# EAGLE board EEZ DIB AFE3 r1B2 (EAGLE 7.2.0)
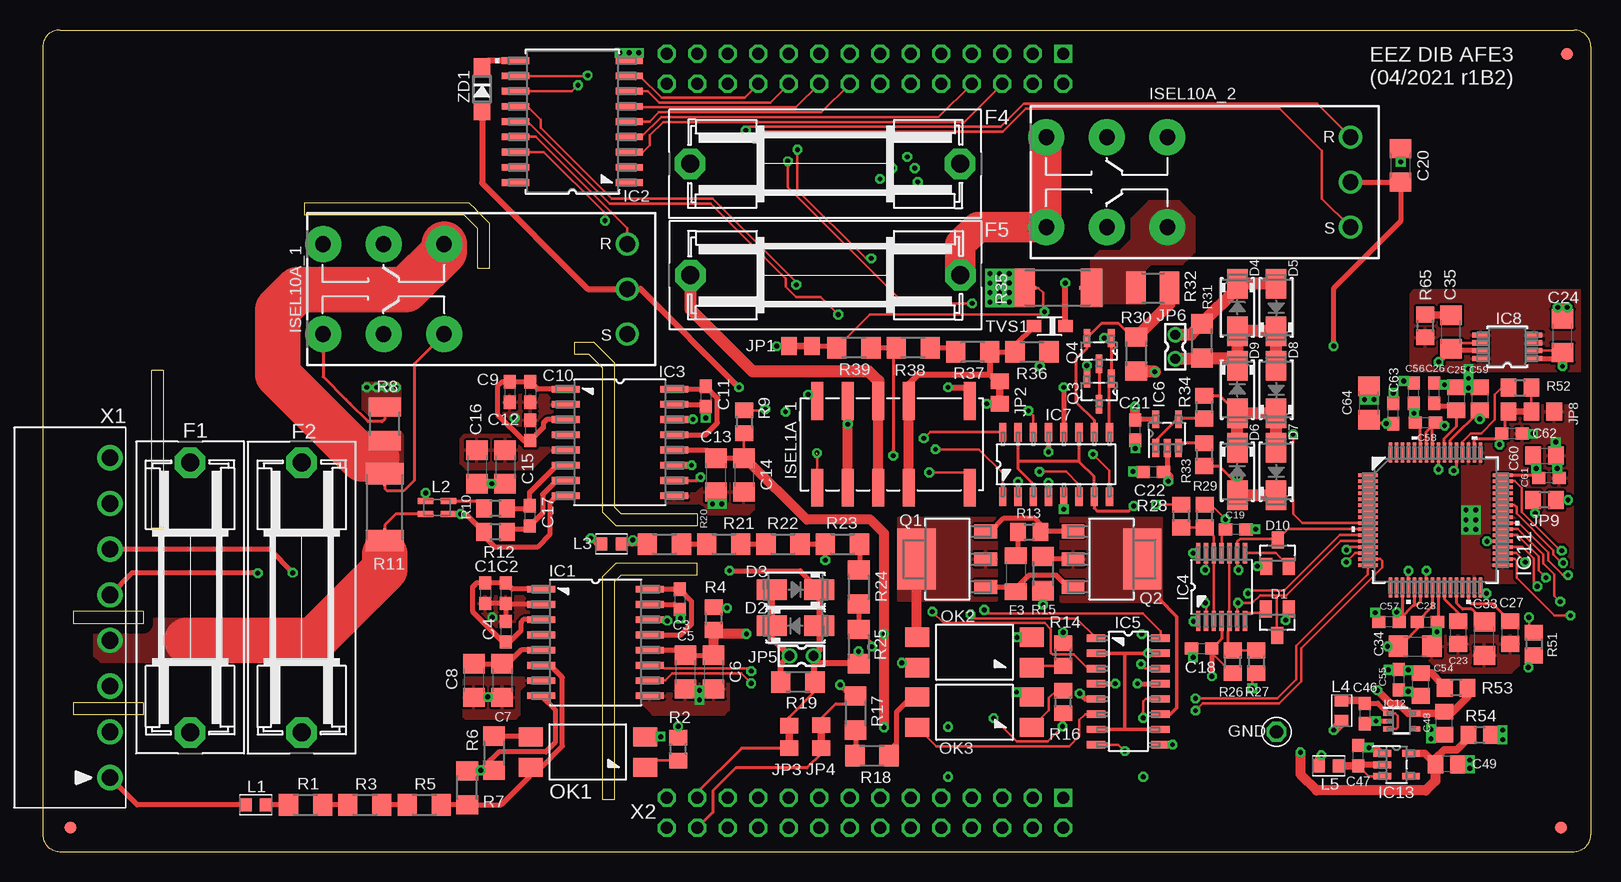
[diagram p4: board, top side]
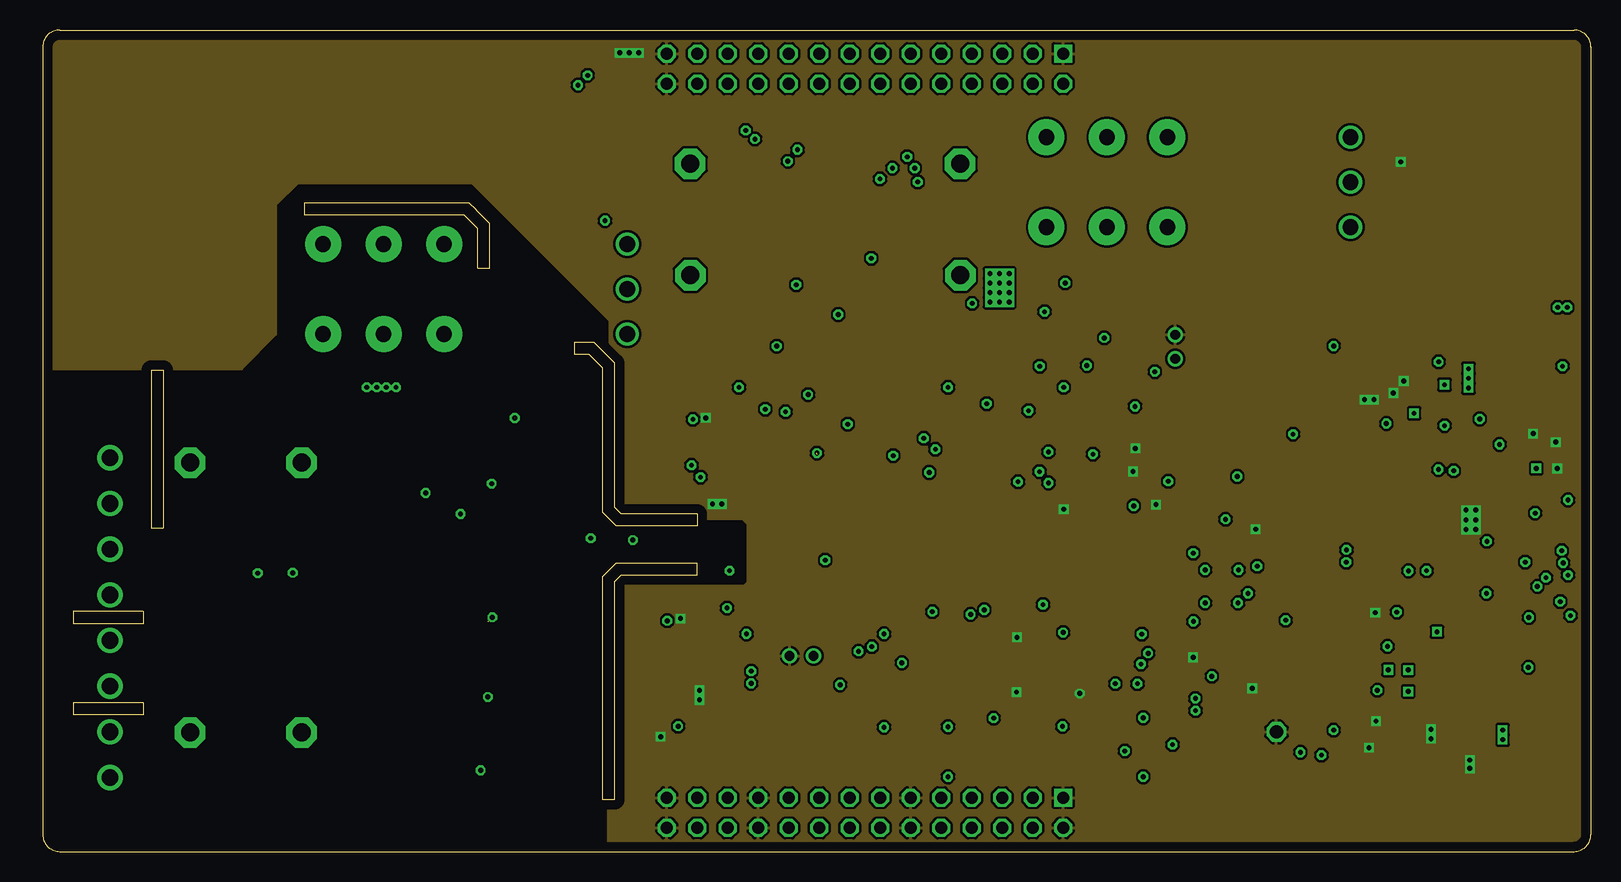
[diagram p5: board, inner layer Gnd]
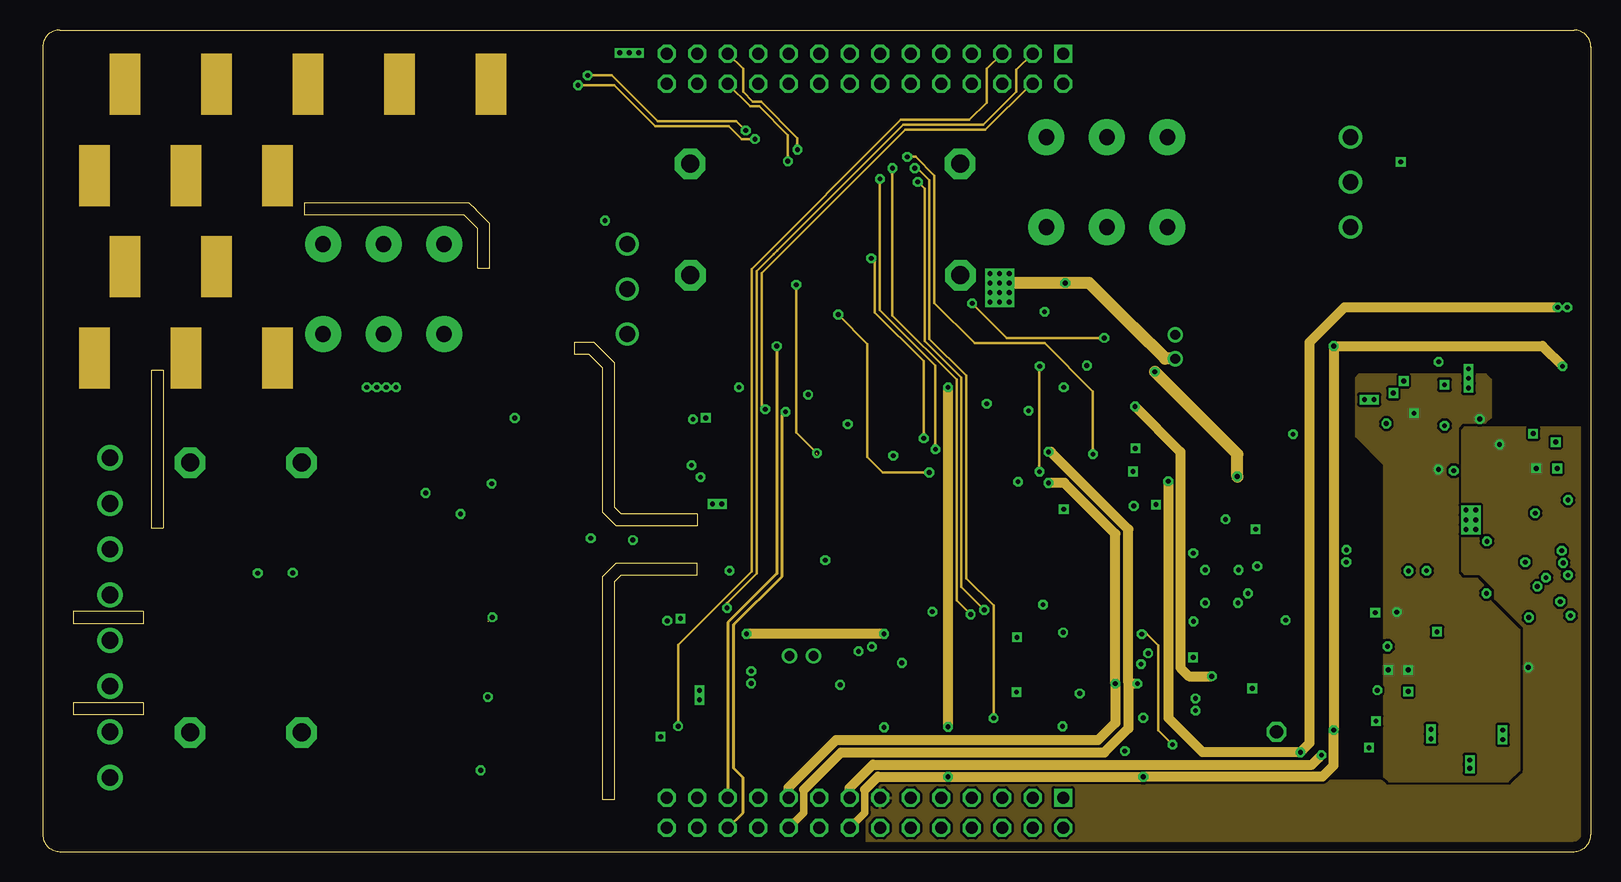
[diagram p6: board, inner layer Power]
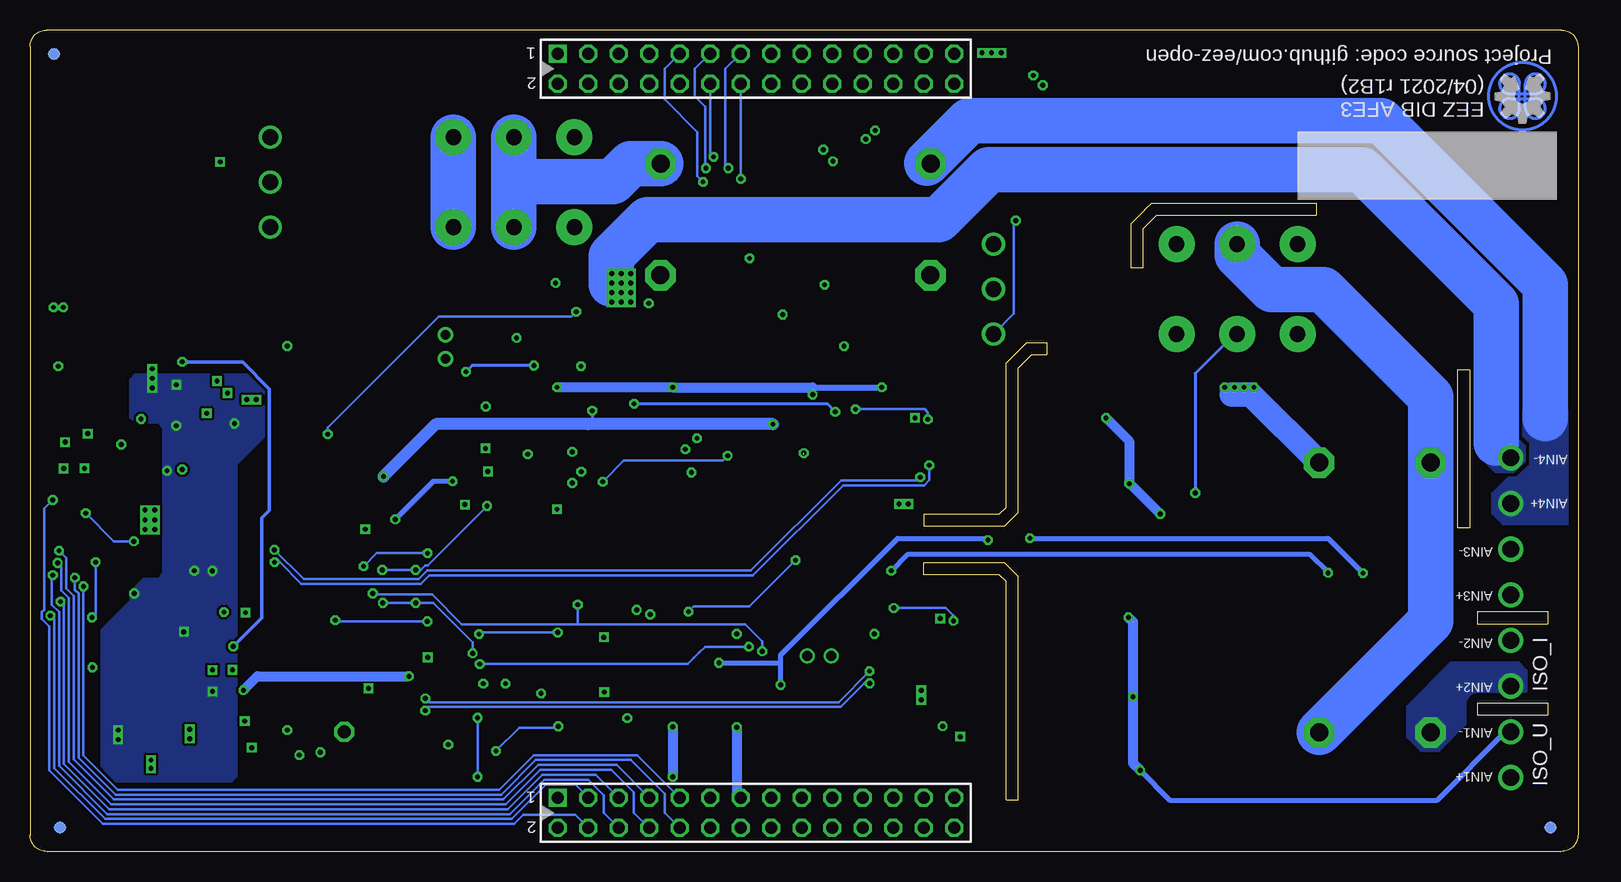
[diagram p7: board, bottom side, seen from below]

Size 129 x 68.5 mm. Coordinates in mm from the lower left corner, seen from the top.
Outline: 36.11,53.5 35.53,54.07 21.81,54.07 21.81,53.06 35.1,53.06 36.23,51.93 36.23,48.66 37.25,48.66 37.25,52.36 36.12,53.49
Outline: 46.52,41.87 45.95,42.44 44.28,42.44 44.28,41.42 45.52,41.42 46.65,40.29 46.65,28.27 47.78,27.14 54.53,27.14 54.53,28.15 48.21,28.15 47.66,28.7 47.66,40.73 46.53,41.86
Outline: 0,67.1 0,1.4 arc90 1.4,0 127.6,0 arc90 129,1.4 129,67.1 arc90 127.6,68.5 1.4,68.5 arc90 0,67.1
Outline: 8.38,20.01 2.54,20.01 2.54,19 8.38,19 8.38,20.01
Outline: 8.38,12.4 2.54,12.4 2.54,11.39 8.38,11.39 8.38,12.4
Outline: 9.03,40.14 9.03,27 10.05,27 10.05,40.14 9.03,40.14
Outline: 48.21,23.06 54.53,23.06 54.53,24.08 47.78,24.08 46.65,22.95 46.65,4.3 47.66,4.3 47.66,22.51 48.21,23.06
Copper layers (1+2+15+16): Top 0.035559375mm / dielectric 7mil / Gnd 0.03048125mm / dielectric 44mil / Power 0.03048125mm / dielectric 7mil / Bottom 0.035559375mm
Design rules "DIB 4-layer *": minimum track width 6mil, minimum drill 0.3mm, track to track 4mil, track to pad 4mil, pad to pad 4mil, via to via 4mil, smd to smd 4mil, copper to edge 30mil, drill to drill 8mil, minimum pad ring 4mil, minimum via ring 8mil, stop-mask expansion 2.5mil, vias tented up to drill 0.6mm, thermal gap 8mil
Net classes: 0 default: width 0.152 mm, drill 0.3 mm, clearance 0.152 mm; 1 lvds: width 0.152 mm, drill 0.3 mm, clearance 0.152 mm to class 0, clearance 0.152 mm; 2 gnd: width 0.254 mm, drill 0.584 mm, clearance 0.254 mm; 3 diff_in: width 0.254 mm, drill 0.584 mm, clearance 0.203 mm to class 0, clearance 0.203 mm to class 1, clearance 0.203 mm to class 2, clearance 0.203 mm
vRestrict: area 0,34.5 to 21,68.5

## Footprints (pad centres in the part's own frame; a part is rotated, then mirrored left to right if it is on the bottom)
C0603 = smd 1.1 x 1: 1 -0.85,0; 2 0.85,0
C1206 = smd 1.6 x 1.8: 1 -1.4,0; 2 1.4,0
C0805 = smd 1.3 x 1.5: 1 -0.95,0; 2 0.95,0
SOT23 = smd 1 x 1.4: 1 -0.95,-1.1; 2 0.95,-1.1; 3 0,1.1
SMA_NARROW = smd 2.464 x 1.702: 1 -1.981,0; 2 1.981,0
ZH32 = drill 1.5 pad 2.54 octagon: 1 -11.25,0; 2 11.25,0
C1206-HV = smd 1.4 x 1.8: 1 -1.5,0; 2 1.5,0
FIDUCIAL_DUAL = smd 1.016 x 1.016 bottom: B 0,0 | smd 1.016 x 1.016: T 0,0
PCB_SHIELD_TAB = drill 1.1 octagon: 1 0,0
DW16 = smd 2.311 x 0.559: 1 -4.521,4.445; 2 -4.521,3.175; 3 -4.521,1.905; 4 -4.521,0.635; 5 -4.521,-0.635; 6 -4.521,-1.905; 7 -4.521,-3.175; 8 -4.521,-4.445; 9 4.521,-4.445; 10 4.521,-3.175; 11 4.521,-1.905; 12 4.521,-0.635; 13 4.521,0.635; 14 4.521,1.905; 15 4.521,3.175; 16 4.521,4.445
DW18_TEX-M = smd 2.286 x 0.559: 1 -4.737,5.08; 2 -4.737,3.81; 3 -4.737,2.54; 4 -4.737,1.27; 5 -4.737,0; 6 -4.737,-1.27; 7 -4.737,-2.54; 8 -4.737,-3.81; 9 -4.737,-5.08; 10 4.737,-5.08; 11 4.737,-3.81; 12 4.737,-2.54; 13 4.737,-1.27; 14 4.737,0; 15 4.737,1.27; 16 4.737,2.54; 17 4.737,3.81; 18 4.737,5.08
PW(R-PDSO-G14) = smd 1.676 x 0.356: 1 -2.819,1.95; 2 -2.819,1.3; 3 -2.819,0.65; 4 -2.819,0; 5 -2.819,-0.65; 6 -2.819,-1.3; 7 -2.819,-1.95; 8 2.819,-1.95; 9 2.819,-1.3; 10 2.819,-0.65; 11 2.819,0; 12 2.819,0.65; 13 2.819,1.3; 14 2.819,1.95
SO16 = smd 1.549 x 0.61: 1 -2.692,4.445; 2 -2.692,3.175; 3 -2.692,1.905; 4 -2.692,0.635; 5 -2.692,-0.635; 6 -2.692,-1.905; 7 -2.692,-3.175; 8 -2.692,-4.445; 9 2.692,-4.445; 10 2.692,-3.175; 11 2.692,-1.905; 12 2.692,-0.635; 13 2.692,0.635; 14 2.692,1.905; 15 2.692,3.175; 16 2.692,4.445
DBV5 = smd 1.473 x 0.559: 1 -1.194,0.95; 2 -1.194,0; 3 -1.194,-0.95; 4 1.194,-0.95; 5 1.194,0.95
MSOP-8_MS_LIT = smd 1.359 x 0.432: 1 -2.229,0.975; 2 -2.229,0.325; 3 -2.229,-0.325; 4 -2.229,-0.975; 5 2.229,-0.975; 6 2.229,-0.325; 7 2.229,0.325; 8 2.229,0.975
PAG64 = smd 1.664 x 0.279: 1 -5.62,3.75; 2 -5.62,3.25; 3 -5.62,2.75; 4 -5.62,2.25; 5 -5.62,1.75; 6 -5.62,1.25; 7 -5.62,0.75; 8 -5.62,0.25; 9 -5.62,-0.25; 10 -5.62,-0.75; 11 -5.62,-1.25; 12 -5.62,-1.75; 13 -5.62,-2.25; 14 -5.62,-2.75; 15 -5.62,-3.25; 16 -5.62,-3.75; 33 5.62,-3.75; 34 5.62,-3.25; 35 5.62,-2.75; 36 5.62,-2.25; 37 5.62,-1.75; 38 5.62,-1.25; 39 5.62,-0.75; 40 5.62,-0.25; 41 5.62,0.25; 42 5.62,0.75; 43 5.62,1.25; 44 5.62,1.75; 45 5.62,2.25; 46 5.62,2.75; 47 5.62,3.25; 48 5.62,3.75 | smd 0.279 x 1.664: 17 -3.75,-5.62; 18 -3.25,-5.62; 19 -2.75,-5.62; 20 -2.25,-5.62; 21 -1.75,-5.62; 22 -1.25,-5.62; 23 -0.75,-5.62; 24 -0.25,-5.62; 25 0.25,-5.62; 26 0.75,-5.62; 27 1.25,-5.62; 28 1.75,-5.62; 29 2.25,-5.62; 30 2.75,-5.62; 31 3.25,-5.62; 32 3.75,-5.62; 49 3.75,5.62; 50 3.25,5.62; 51 2.75,5.62; 52 2.25,5.62; 53 1.75,5.62; 54 1.25,5.62; 55 0.75,5.62; 56 0.25,5.62; 57 -0.25,5.62; 58 -0.75,5.62; 59 -1.25,5.62; 60 -1.75,5.62; 61 -2.25,5.62; 62 -2.75,5.62; 63 -3.25,5.62; 64 -3.75,5.62
DCK5 = smd 0.85 x 0.4: 1 -1.125,0.65; 2 -1.125,0; 3 -1.125,-0.65; 4 1.125,-0.65; 5 1.125,0.65
G6SK-2F = smd 1 x 3.16: 1 -6.35,-3.62; 3 -1.27,-3.62; 4 1.27,-3.62; 5 3.81,-3.62; 6 6.35,-3.62; 7 6.35,3.62; 8 3.81,3.62; 9 1.27,3.62; 10 -1.27,3.62; 12 -6.35,3.62
RT424FXX = drill 1.3 pad 3: 11 20.3,-3.75; 12 15.26,-3.75; 14 25.34,-3.75; 21 20.3,3.75; 22 15.26,3.75; 24 25.34,3.75 | drill 1.3: A1 0,-3.75; A2 0,3.75; A3 0,0
JP2-0805-NOCUT = smd 1.3 x 1.5: 1 -0.95,0; 2 0.95,0
2MM-2 = drill 0.8 pad 1.27: 1 0,-1; 2 0,1
JP3-0805-CUT2 = smd 1.3 x 1.5: COM 0,0; NC 1.9,0; NO -1.9,0
R_0805 = smd 1.3 x 1.5: 1 -0.95,0; 2 0.95,0
BEAD0603 = smd 1 x 1.1: P$1 -0.85,0; P$2 0.85,0
MURATA_DLW21S = smd 1.3 x 0.5: 1 -0.95,-0.55; 2 0.95,-0.55; 3 0.95,0.55; 4 -0.95,0.55
DIL4-SMD = smd 1.6 x 2: 1 -1.27,-4.77; 2 1.27,-4.77; 3 1.27,4.77; 4 -1.27,4.77
SOT230P700X180-4N = smd 1.905 x 1.143: 1 -3.2,2.311; 2 -3.2,0; 3 -3.2,-2.311 | smd 3.175 x 5.08: 4 2.565,0
SOT103P240X110-3N = smd 1.524 x 0.559: 1 -1.079,1.016; 2 -1.079,-1.016; 3 1.079,0
R1206 = smd 1.6 x 1.803: 1 -1.422,0; 2 1.422,0
R0805 = smd 1.3 x 1.5: 1 -0.95,0; 2 0.95,0
R1210 = smd 1.6 x 2.7: 1 -1.4,0; 2 1.4,0
R_2512-4WIRE = smd 1.8 x 3.2: 1 -2.8,0; 2 2.8,0 | smd 1.27 x 0.254: 1S -2.413,0; 2S 2.413,0
SOD323-BIDIR = smd 1.2 x 1: C1 -1.3,0; C2 1.3,0
691322310008 = drill 1.4: 1 -13.335,0; 2 -9.525,0; 3 -5.715,0; 4 -1.905,0; 5 1.905,0; 6 5.715,0; 7 9.525,0; 8 13.335,0
TSW-114-07-F-D = drill 1 pad 1.5 square: 1 33.02,0 | drill 1 pad 1.5 octagon: 2 33.02,2.54; 3 30.48,0; 4 30.48,2.54; 5 27.94,0; 6 27.94,2.54; 7 25.4,0; 8 25.4,2.54; 9 22.86,0; 10 22.86,2.54; 11 20.32,0; 12 20.32,2.54; 13 17.78,0; 14 17.78,2.54; 15 15.24,0; 16 15.24,2.54; 17 12.7,0; 18 12.7,2.54; 19 10.16,0; 20 10.16,2.54; 21 7.62,0; 22 7.62,2.54; 23 5.08,0; 24 5.08,2.54; 25 2.54,0; 26 2.54,2.54; 27 0,0; 28 0,2.54
SOD123 = smd 1.4 x 1.4: A 1.9,0; C -1.9,0

## Placement (x,y rotation side)
C1  1u  [C0603]  36.88,21.54 270 top
C2  1n  [C0603]  38.6,21.54 270 top
C3  100n  [C0603]  53.06,21.03 270 top
C4  100n  [C0603]  38.6,18.34 270 top
C5  1n  [C1206]  53.54,14.97 270 top
C6  1u  [C1206]  55.89,14.97 270 top
C7  100n  [C1206]  38.28,14.26 270 top
C8  1n  [C1206]  35.93,14.26 270 top
C9  1u  [C0603]  38.91,38.31 270 top
C10  1n  [C0603]  40.63,38.31 270 top
C11  100n  [C0603]  55.24,37.94 270 top
C12  100n  [C0603]  40.63,35.11 270 top
C13  1n  [C1206]  56.08,31.39 270 top
C14  1u  [C1206]  58.43,31.39 270 top
C15  100n  [C1206]  38.53,32.06 270 top
C16  1n  [C1206]  36.18,32.06 270 top
C17  8n2  [C0603]  40.56,27.99 270 top
C18  100n  [C0603]  96.57,16.93 0 top
C19  100n  [C0603]  99.42,26.86 180 top
C20  10u  [C1206]  113.16,57.21 90 top
C21  100n  [C0603]  91.03,35.14 90 top
C22  100n  [C0603]  92.54,31.66 0 top
C23  1u  [C0805]  117.97,18.26 90 top
C24  N.C.  [C1206]  126.64,43.01 90 top
C25  1u  [C0805]  117.79,37.75 270 top
C26  100n  [C0603]  115.95,38.22 90 top
C27  1u  [C0805]  122.29,18.26 90 top
C28  100n  [C0603]  115.38,19.15 0 top
C33  22u  [C1206]  120.13,17.75 90 top
C34  10u  [C1206]  114.36,17.12 0 top
C35  N.C.  [C1206]  117.35,43.32 90 top
C46  100n  [C0603]  110.16,11.52 270 top
C47  100n  [C0603]  109.64,8 90 top
C48  1u  [C0805]  116.79,10.7 90 top
C49  1u  [C0805]  117.01,7.29 180 top
C54  1u  [C0805]  114.82,13.93 90 top
C55  100n  [C0603]  112.98,14.34 270 top
C56  100n  [C0603]  114.25,38.22 90 top
C57  100n  [C0603]  112.18,19.15 180 top
C58  100n  [C0603]  115.21,35.76 0 top
C59  1u  [C0805]  119.75,37.75 270 top
C60  1u  [C0805]  125.15,33 0 top
C61  100n  [C0603]  125.51,31.16 180 top
C62  100n  [C0603]  122.43,34.85 180 top
C63  100n  [C0603]  112.55,36.52 90 top
C64  10u  [C1206]  110.52,37.4 90 top
D1  BAV199,235  [SOT23]  102.87,19.12 180 top
D2  SA2M-E3/61T  [SMA_NARROW]  62.73,18.82 0 top
D3  SA2M-E3/61T  [SMA_NARROW]  62.73,21.84 180 top
D4  SA2M-E3/61T  [SMA_NARROW]  99.54,45.36 270 top
D5  SA2M-E3/61T  [SMA_NARROW]  102.78,45.36 90 top
D6  SA2M-E3/61T  [SMA_NARROW]  99.54,31.68 270 top
D7  SA2M-E3/61T  [SMA_NARROW]  102.78,31.68 90 top
D8  SA2M-E3/61T  [SMA_NARROW]  102.78,38.52 90 top
D9  SA2M-E3/61T  [SMA_NARROW]  99.54,38.52 270 top
D10  BAV199,235  [SOT23]  102.9,24.88 0 top
EEZ_SIGNATURE  SIGNATURESMALL  [SIGNATURE_5MM]  4.63,62.98 180 top
F1  ZH32 (10A)  [ZH32]  12.28,21.18 270 top
F2  ZH32 (1.25A)  [ZH32]  21.58,21.18 90 top
F3  SN005-60  [C1206-HV]  81.08,23.17 270 top
F4  ZH32 (10A)  [ZH32]  65.2,57.34 180 top
F5  ZH32 (1.25A)  [ZH32]  65.21,48.05 0 top
FM1  FIDUCIAL_2  [FIDUCIAL_DUAL]  2.3,2 0 top
FM2  FIDUCIAL_2  [FIDUCIAL_DUAL]  127,66.5 0 top
FM3  FIDUCIAL_2  [FIDUCIAL_DUAL]  126.5,2 0 top
GND  [PCB_SHIELD_TAB]  102.81,9.98 0 top
IC1  AMC3330QDWERQ1  [DW16]  46.06,17.43 0 top
IC2  ULN2803ADWR  [DW18_TEX-M]  44.13,60.86 180 top
IC3  AMC3301DWER  [DW16]  48.09,34.11 0 top
IC4  MCP6004T-I/ST  [PW(R-PDSO-G14)]  98.23,22.06 90 top
IC5  DG212BDY-T1-E3  [SO16]  90.46,13.36 0 top
IC6  MCP6001T-I/OT  [DBV5]  93.7,34.85 90 top
IC7  DG212BDY-T1-E3  [SO16]  84.44,32.28 90 top
IC8  N.C.  [MSOP-8_MS_LIT]  122.05,42.08 180 top
IC11  ADS131E04IPAGR  [PAG64]  116.05,27.63 0 top
IC12  TPS71725DCKR  [DCK5]  113.23,10.87 0 top
IC13  TPS72325DBVR  [DBV5]  112.81,7.24 0 top
ISEL1A_1  EE2-5TNU-L  [G6SK-2F]  70.89,33.96 180 top
ISEL10A_1  RT424F05  [RT424FXX]  48.7,46.9 180 top
ISEL10A_2  RT424F05  [RT424FXX]  108.98,55.81 180 top
JP1  JP2-NOCUT-0805  [JP2-0805-NOCUT]  63.14,42.14 180 top
JP2  JP2-NOCUT-0805  [JP2-0805-NOCUT]  79.76,38.27 90 top
JP3  JP2-NOCUT-0805  [JP2-0805-NOCUT]  62.19,9.56 270 top
JP4  JP2-NOCUT-0805  [JP2-0805-NOCUT]  64.86,9.59 90 top
JP5  DS1025-01-1*2P8BV1-B  [2MM-2]  63.23,16.32 90 top
JP6  DS1025-01-1*2P8BV1-B  [2MM-2]  94.37,42.08 0 top
JP8  JP3-CUT-0805-ROTATED  [JP3-0805-CUT2]  124.05,36.69 180 top
JP9  JP2-CUT-0805  [R_0805]  125.15,29.31 180 top
L1  MLZ1608N100LT000  [BEAD0603]  17.74,3.9 180 top
L2  DLW21SN371SQ2L  [MURATA_DLW21S]  32.84,28.69 0 top
L3  MLZ1608N100LT000  [BEAD0603]  47.4,25.64 180 top
L4  BLM18AG102SH1D  [BEAD0603]  108.23,11.76 270 top
L5  BLM18AG102SH1D  [BEAD0603]  107.16,7.15 180 top
OK1  VOR1142B4  [DIL4-SMD]  45.42,8.3 90 top
OK2  VOR1142B4  [DIL4-SMD]  77.64,16.61 90 top
OK3  VOR1142B4  [DIL4-SMD]  77.65,11.62 90 top
Q1  CPC3902ZTR  [SOT230P700X180-4N]  75.37,24.38 180 top
Q2  CPC3902ZTR  [SOT230P700X180-4N]  89.05,24.38 0 top
Q3  BSS214NH6327XTSA1  [SOT103P240X110-3N]  88.02,38.36 270 top
Q4  BSS214NH6327XTSA1  [SOT103P240X110-3N]  88.02,41.74 270 top
R1  1M5 0.1%  [R1206]  21.89,3.9 180 top
R2  470R  [R0805]  52.95,8.54 90 top
R3  1M5 0.1%  [R1206]  26.84,3.9 180 top
R4  N.C.  [R0805]  55.89,19.43 270 top
R5  1M5 0.1%  [R1206]  31.79,3.9 180 top
R6  10K5 0.1%  [R1206]  37.6,8.2 90 top
R7  82K5 0.1%  [R1206]  35.37,5.32 270 top
R8  0R220  [R1210]  28.5,35.66 90 top
R9  N.C.  [R0805]  58.45,35.84 270 top
R10  10R  [R0805]  37.73,28.61 180 top
R11  GMR100HTBFA10L0  [R_2512-4WIRE]  28.5,28.71 90 top
R12  10R  [R0805]  37.73,26.64 180 top
R13  15R  [R0805]  82.21,26.65 0 top
R14  470R  [R0805]  85.04,16.43 90 top
R15  50R 0.1%  [R1206]  83.35,23.17 90 top
R16  470R  [R0805]  85.04,12.48 90 top
R17  49K9  [R1206]  67.73,11.55 90 top
R18  49K9  [R1206]  69.1,8 180 top
R19  100K  [R1206]  62.93,14.13 0 top
R20  4M7 0.1%  [R1206]  51.8,25.64 180 top
R21  4M7 0.1%  [R1206]  56.74,25.64 180 top
R22  100K 0.1%  [R1206]  61.68,25.64 180 top
R23  200K 0.1%  [R1206]  66.64,25.64 180 top
R24  200K 0.1%  [R1206]  68,22.06 90 top
R25  100K 0.1%  [R1206]  68,17.09 90 top
R26  330R  [R0805]  99.16,15.82 90 top
R27  10K  [R0805]  101.13,15.82 270 top
R28  10K  [R0805]  94.86,27.97 270 top
R29  330R  [R0805]  96.82,27.97 90 top
R30  33R  [R1206]  91.12,41.47 270 top
R31  100K  [R1206]  96.6,42.58 270 top
R32  0R33  [R1210]  92.49,46.99 0 top
R33  10K  [R0805]  96.79,33.09 270 top
R34  1K  [R0805]  96.8,37.06 90 top
R35  GMR100HTBFA10L0  [R_2512-4WIRE]  84.58,47 0 top
R36  100K  [R1206]  82.44,41.65 180 top
R37  200K 0.1%  [R1206]  77.5,41.65 0 top
R38  200K 0.1%  [R1206]  72.54,42.01 0 top
R39  100K 0.1%  [R1206]  67.59,42.01 0 top
R51  10K  [R0805]  124.26,17.31 270 top
R52  10K  [R0805]  123.1,38.67 0 top
R53  10R  [R0805]  117.78,13.66 180 top
R54  10R  [R0805]  119.75,9.71 180 top
R65  N.C.  [R0805]  115.19,43.82 270 top
TVS1  PESD12VL1BA,115  [SOD323-BIDIR]  83.91,43.81 180 top
X1  691322310008  [691322310008]  5.6,19.5 90 top
X2  DS1023-2*14S21  [TSW-114-07-F-D]  52,4.5 180 bottom
X3  DS1023-2*14S21  [TSW-114-07-F-D]  52,66.54 180 bottom
ZD1  MMSZ5230BT1G  [SOD123]  36.6,63.56 270 top

## Tracks (layer width: path | path; a pad name or v marks a point on that pad's centre or on a via)
!ADC_CS  (via drill 0.4)
  Top 0.203: IC11.39 122.92,26.89 125.06,24.76 125.06,24.04 125.97,23.12 125.97,21.32 v126.45,20.84
  Bottom 0.203: X2.5 81.84,6.4 86.32,6.4 89.19,3.53 122.39,3.53 126.17,7.31 126.17,20.56 v126.45,20.84
!ADC_DRDY  (via drill 0.4)
  Top 0.203: IC11.47 122.67,30.88 123.23,30.32 123.23,28.33 126.48,25.08 v126.58,25.08
  Bottom 0.203: X2.7 80.12,7.22 86.67,7.22 89.55,4.34 122.03,4.34 125.36,7.67 125.36,21.33 125.98,21.95 125.98,24.48 v126.58,25.08
!RESET  (via drill 0.4)
  Top 0.203: IC11.36 123.28,25.39 124.24,24.43 124.24,22.35 v124.55,22.11
  Bottom 0.203: X2.9 78.4,8.04 87.02,8.04 89.9,5.15 121.69,5.15 124.55,8.01 v124.55,22.11
+2V5_ADC  (via drill 0.4)
  Top 0.203: 113.3,19.47 113.3,19.42 C57.1 | v112.84,19.96 113.26,19.96 113.3,20
  Top 0.254: IC11.54 117.3,34.29 119.75,36.74 | C59.2 119.75,36.74 | IC11.59 114.8,35.32 C58.1 | IC11.22 114.8,20.87 114.48,20.55 114.31,20.55 | IC11.21 114.3,20.55 114.31,20.55 | IC11.19 113.3,20 113.3,19.47 | 119.75,36.74 v119.75,36.06 | IC11.56 v116.3,31.85 v116.31,31.85 | 114.31,20.55 114.25,20.55 113.03,19.32 C57.1
  Top 0.305: 112.97,15.2 C55.1 114.51,15.19 | C54.2 114.51,15.19 | 114.51,15.19 114.46,15.13 v113.79,15.13 | 114.36,37.26 114.28,37.17 v114.28,36.53
  Top 0.406: C56.1 114.36,37.26 C58.1
  Top 0.61: C54.2 115.75,14.88 R53.2
  other vias: 112.13,15.15
  pour Power (isolate 0.203): 120.66,39.35 120.66,36.2 120.22,35.76 118.33,35.76 117.89,35.33 117.89,23.17 118.33,22.74 119.52,22.74 120.61,21.65 120.61,20.89 123.04,18.46 123.04,6.79 122.09,5.84 112.19,5.84 111.8,6.23 111.8,32.24 109.44,34.6 109.44,39.48 109.72,39.76 120.26,39.76
+2V5_ISO  (via drill 0.4)
  Top 0.203: R26.1 99.11,14.87 97.54,16.44 97.42,16.33
  Top 0.254: IC4.4 98.23,17.74 C18.2
  Top 0.406: C18.2 97.42,16.33 v97.42,14.62 v97.42,14.61 | IC6.5 91.08,36.04 C21.2
  Top 0.61: v111.21,13.45 112.34,12.32 112.98,12.32 113.78,11.52 IC12.5 116.65,11.52 C48.2 117.5,11.65 118.73,12.88 R53.1
  Top 0.813: C21.2 91.03,37.09 v91.02,37.11
  Power 0.813: v97.42,14.61 95.5,14.61 94.81,15.31 94.81,33.32 v91.02,37.11
  Bottom 0.813: v111.21,13.45 110.05,14.61 v97.42,14.61
+3V3_ISO  (via drill 0.4)
  Top 0.203: 124.44,31.38 124.46,31.4 v124.46,31.95 | R51.2 123.8,15.9 v123.8,15.35 | R9.2 58.43,34.87 C14.1
  Top 0.254: IC11.50 119.3,34.28 119.44,34.43 121.4,34.43 | 123.91,33.29 C60.1 123.98,32.79 v124.46,31.95 | IC11.48 124.44,31.38 C61.2 | 121.4,34.43 121.49,34.43 C62.2 121.84,34.85 121.84,36.62 122.15,36.62 JP8.NC | v121.4,33.94 121.4,34.43
  Top 0.406: IC3.12 55.4,33.47 C13.1 C14.1 | IC1.12 53.11,16.8 C5.1 C6.1
  Top 0.813: v70.1,10.36 v70.1,18.14 70.1,26.53 68.96,27.67 63.66,27.67 58.54,32.79 C14.1 | C6.1 55.89,17.98 | 55.89,17.98 R4.2 | 55.94,18.53 R4.2 | 55.93,18.02 55.89,17.98 | v58.64,18.14 56.23,18.14 R4.2
  Power 0.813: v70.1,18.14 v58.64,18.14
  Bottom 0.813: v70.1,10.36 70.1,4.82 X2.13
  pour Power (isolate 0.203, rank 2): 68.64,0.49 68.64,4.87 69.66,5.89 122.56,5.89 123.44,6.78 123.44,18.65 121.03,21.07 121.03,21.83 119.7,23.16 118.49,23.16 118.3,23.35 118.3,35.16 118.49,35.35 128.7,35.35 128.7,1 128.13,0.43 68.71,0.43
+5V_ISO  (via drill 0.4)
  Top 0.203: 93.57,12.72 IC5.12 91.92,12.72 91.71,12.51 v91.71,11.15 | IC8.2 126.5,41.76 C24.1
  Top 0.406: v63.78,38.1 64.17,37.94 ISEL1A_1.6 | 77.14,38.71 77.19,38.66 77.19,37.63 ISEL1A_1.1 | v85.08,38.71 IC7.12 | v107.57,42.15 107.57,46.96 113.16,52.55 C20.1 ISEL10A_2.A3 | IC8.1 126.14,41.11 C24.1
  Top 0.508: ZD1.A 36.6,55.74 45.43,46.91 ISEL10A_1.A3 49.82,46.9 v58.01,38.71 | v75.44,38.71 77.14,38.71
  Top 0.813: L4.P$2 108.23,10.78 v107.57,10.12 | v126.64,40.46 C24.1
  Power 0.61: 68.52,5.15 68.52,3.24 X2.16
  Power 0.813: 68.52,5.15 69.6,6.23 v75.44,6.23 v91.71,6.23 106.63,6.23 107.57,7.17 v107.57,10.12 v107.57,42.15 124.95,42.15 v126.64,40.46 | v75.44,10.4 v75.44,38.71
  Bottom 0.203: v91.71,11.15 v91.71,6.23
  Bottom 0.406: v63.78,38.1 63.78,38.68 63.8,38.71
  Bottom 0.508: 63.8,38.71 v58.01,38.71
  Bottom 0.813: 63.8,38.71 v75.44,38.71 v85.08,38.71 | v75.44,10.4 v75.44,6.23
+15V_ISO  (via drill 0.4)
  Top 0.406: v91.22,13.99 IC5.13 | IC7.13 v83.81,33.32
  Power 0.61: X2.20 63.42,3.22 63.42,5.15
  Power 0.813: 63.42,5.15 66.53,8.26 88.47,8.26 90.46,10.26 90.46,14.04 | 90.46,14.04 90.46,26.86 84,33.32 v83.81,33.32 | v91.22,13.99 90.51,13.99 90.46,14.04
-2V5_ISO  (via drill 0.4)
  Top 0.203: R29.2 97.33,28.93 v98.56,27.7 | IC4.11 98.23,26.53 C19.2
  Top 0.254: 98.53,26.82 C19.2
  Top 0.406: IC6.2 93.7,31.96 C22.2 | v98.56,27.7 C19.2
  Top 0.61: R54.2 118.82,9.47 117.84,8.49 116.78,8.49 116.06,7.77 C49.2 115.16,8.19 IC13.5
  Top 0.813: C49.2 116.06,5.89 115.27,5.1 106.15,5.1 104.8,6.45 v104.8,8.28 | C22.2 93.79,31.26 v93.79,30.87 | v126.24,45.37 v127.04,45.37 126.64,44.98 C24.2
  Power 0.813: v93.79,30.87 93.79,11.13 96.65,8.28 v104.8,8.28 105.55,9.03 105.55,42.45 108.47,45.37 v126.24,45.37
  Bottom 0.406: v93.79,30.87 95.39,30.87 v98.56,27.7
-5V_ISO  (via drill 0.4)
  Top 0.61: L5.P$2 106.31,7.79 v106.55,8.04
  Power 0.813: X2.15 67.24,5.31 69.18,7.25 105.77,7.25 v106.55,8.04
-15V_ISO  (via drill 0.4)
  Top 0.406: v83.81,30.73 IC7.4 | IC5.4 v89.38,13.99
  Power 0.813: X2.19 62.16,5.34 66.12,9.29 87.95,9.29 89.38,10.73 v89.38,13.99 89.38,26.49 85.14,30.73 v83.81,30.73
ADC_CLK  (via drill 0.4)
  Top 0.203: v127.1,29.31 JP9.1
  Bottom 0.203: X2.4 83.58,3.07 87.9,3.07 88.66,2.31 122.92,2.31 127.39,6.78 127.39,18.75 128.02,19.38 128.02,19.96 127.83,20.15 127.83,28.58 v127.1,29.31
ADC_MISO  (via drill 0.4)
  Top 0.203: IC11.43 122.64,28.88 122.81,28.71 122.81,28.18 125.87,25.12 125.87,24.79 126.59,24.06 v126.69,24.06
  Bottom 0.203: X2.8 78.68,3.24 78.68,4.95 80.54,6.82 86.49,6.82 89.37,3.93 122.21,3.93 125.77,7.49 125.77,21.16 126.39,21.78 126.39,23.76 v126.69,24.06
ADC_MOSI  (via drill 0.4)
  Top 0.203: IC11.34 122.68,24.38 122.82,24.24 122.82,22.81 125.96,19.67 v127.31,19.67
  Bottom 0.203: X2.3 82.48,4.51 83.55,5.58 85.97,5.58 88.84,2.71 122.75,2.71 126.99,6.96 126.99,19.35 v127.31,19.67
ADC_SCK  (via drill 0.4)
  Top 0.203: IC11.40 123.01,27.39 125.46,24.94 125.46,24.27 126.68,23.05 v127.1,23.05
  Bottom 0.203: X2.6 81.2,3.22 81.2,4.7 82.5,5.99 86.14,5.99 89.01,3.12 122.57,3.12 126.58,7.13 126.58,19.96 127.18,20.56 127.18,22.97 v127.1,23.05
ADC_START  (via drill 0.4)
  Top 0.203: IC11.38 122.85,26.39 124.65,24.6 124.65,23.44 v125.26,22.83
  Bottom 0.203: X2.10 76.11,3.21 76.11,4.8 78.94,7.63 86.84,7.63 89.72,4.75 121.87,4.75 124.95,7.83 124.95,21.51 125.26,21.82 v125.26,22.83
AIN1N  (via drill 0.4)  (1 unrouted)
  Top 0.406: IC1.2 38.67,20.61 C2.2 | C2.2 C4.1 | C2.2 C1.2 | IC1.8 42.69,11.85 42.69,9.06 41.92,8.3 38.02,8.3 36.85,7.13 | 36.85,7.13 v36.49,6.77 36.46,6.74 R7.1 | R6.1 37.2,6.78 36.85,7.13
  Top 0.813: 37.06,12.86 v37.08,12.89 | C8.2 35.96,12.89 | 35.96,12.89 v37.08,12.89 | 35.96,12.89 35.74,12.89 35.48,12.63 | C7.2 37.11,12.86 v37.09,12.88 v37.08,12.89
  Bottom 0.406: X1.2 6.05,9.97 11.79,4.24 33.96,4.24 v36.49,6.77
  Bottom 0.813: 37.11,19.18 v37.47,19.53 | v36.49,6.77 37.09,7.37 v37.09,12.88 37.09,19.15
  pour Top (isolate 0.203): 36.16,21.26 40.03,21.26 40.47,20.81 40.47,19.3 39.55,19.3 38.99,18.74 37.22,18.74 36.16,19.81
  pour Top (isolate 0.203): 41.74,14.49 35.24,14.49 35.06,14.31 35.06,11.25 35.22,11.1 39.4,11.1 39.71,11.41 39.71,13.4 40.4,14.08 41.74,14.08
AIN1P
  Top 0.406: L1.P$2 7.87,3.9 X1.1
AIN2N
  Top 0.203: 28.79,26.46 R11.1 28.5,24.81
  Top 3.81: 11.98,17.6 11.98,17.59 22.59,17.59 28.51,23.52 28.51,24.8 28.5,24.81
  pour Top (isolate 0.457, no thermals): 12.31,15.8 4.81,15.8 4.28,16.33 4.28,18.88 4.32,18.92 7.89,18.92 8.31,19.34 8.36,19.39 12.26,19.39 12.31,19.34
AIN2P
  pour Bottom (isolate 0.254, no thermals): 4.84,12.84 9.07,12.84 9.39,12.52 9.39,10.59 11.58,8.39 13.11,8.39 14.25,9.53 14.25,12.11 10.6,15.76 4.95,15.76 4.31,15.11 4.31,13.37
AIN3P  (via drill 0.4)
  Top 0.254: JP4.2 64.86,11.08 66.09,12.32 67.07,12.32 R17.2
  Top 0.406: v71.59,15.73 72.47,15.73 OK2.4 | R17.2 67.37,12.98 v66.45,13.9 | R20.2 49.09,25.64 | 49.09,25.64 L3.P$1 | v49.17,25.97 49.07,25.65 49.09,25.64
  Bottom 0.406: v71.59,15.73 66.47,15.73 66.45,15.76 | v66.45,13.9 66.45,15.76 | 66.45,15.76 66.45,16.38 56.71,26.12 49.33,26.12 v49.17,25.97
AIN4N  (via drill 0.4)
  Top 0.406: R35.1 80.94,47 80.54,47.39 v80.53,47.41
  Top 0.508: TVS1.C1 v85.2,47.41
  Top 1.016: D8.2 D5.1 D4.2 D9.1 98.88,41.16 R31.2 96.52,41.08 JP6.1 | v80.53,47.41 v79.73,47.41
  Power 1.016: JP6.1 93.52,41.08 90.96,43.65 | 90.96,43.65 90.96,43.66 | v80.53,47.41 v85.2,47.41 87.2,47.41 90.96,43.65
  Bottom 0.406: v78.93,48.19 v79.73,48.19 v79.73,47.41 78.94,47.41 v78.93,47.39 v78.93,46.59 | v78.93,45.81 v78.93,46.59 | v79.73,45.81 v80.53,45.81 v80.53,46.61 v80.53,47.41 | v79.73,46.61 78.94,46.61 v78.93,46.59 | v80.53,48.19 v80.53,47.41 | 80.54,47.32 80.54,47.39 v80.53,47.41
  Bottom 3.81: 6.81,34.04 6.81,45.65 18.02,56.87 49.11,56.87 53.28,52.7 77.51,52.7 80.54,49.67 80.54,47.32
  pour Bottom (isolate 0.254, no thermals): 8.61,34.95 8.28,33 6.91,31.63 5.33,31.63 4.45,32.52 4.45,33.82 5,34.38 5,34.95
AIN4P
  Bottom 0.508: F4.2 54.25,57.4 54.13,57.52
  Bottom 3.81: 2.74,36.1 2.74,47.29 16.4,60.94 50.71,60.94 54.13,57.52 54.27,57.39
  pour Bottom (isolate 0.254, rank 2, no thermals): 0.46,36.74 4.55,36.74 4.55,32.45 7.14,29.85 7.14,28.18 6.26,27.3 0.64,27.3 0.46,27.48
AIN4P_FUSED
  Top 0.813: ISEL1A_1.9 ISEL1A_1.4
  Top 1.016: ISEL1A_1.4 69.62,39.24 68.82,40.04 59.14,40.04 54.42,44.76 54.12,45.07 53.97,45.22 F5.1
AIN_U4
  Top 0.406: R37.2 R36.2 81.01,42.22 TVS1.C2 | JP2.2 79.4,39.22 78.89,39.73
  Top 0.508: R37.2 78.92,39.76 78.89,39.73 72.91,39.73 72.16,38.99 ISEL1A_1.3
  Top 0.813: ISEL1A_1.10 ISEL1A_1.3
AVSS  (via drill 0.4)
  Top 0.203: v120.31,21.52 119.84,21.52 119.81,21.5 119.81,22 IC11.32 | C59.1 | C26.2 116.65,39.07 v116.8,38.92 117.02,38.7 C25.1 | C28.2 116.23,18.37 v116.18,18.32 116.18,17.53 C34.2
  Top 0.254: IC11.25 116.3,19.67 | 116.3,19.67 116.3,19.22 C28.2 | 115.9,19.27 116.3,19.67 | C63.1 111.99,35.66 v111.96,35.68 111.03,35.68 C64.1 | IC11.57 115.8,35.5 C58.2 | v116.81,35.51 116.32,35.51 C58.2 | IC11.58 115.3,35 C58.2 | IC11.20 v113.8,23.4 v113.81,23.4 | IC11.53 117.8,31.97 v117.58,31.75 | IC11.23 115.3,23.4 v115.32,23.42
  Top 0.305: C55.2 113.22,13.24 v113.79,13.34 114.56,13.24 C54.1
  Top 0.406: C59.1 119.36,38.31 v118.81,38.66
  Top 0.61: R54.1 120.94,9.87 v121.65,10.12
  Bottom 0.305: v118.81,40.26 v118.81,39.46
  other vias: 121.65,9.33
  pour Bottom (isolate 0.203): 120.66,39.35 120.66,36.2 120.22,35.76 118.33,35.76 117.89,35.33 117.89,23.17 118.33,22.74 119.52,22.74 120.61,21.65 120.61,20.89 123.04,18.46 123.04,6.79 122.73,6.04 122.53,5.84 112.19,5.84 111.8,6.23 111.8,32.24 109.44,34.6 109.44,39.48 109.72,39.76 120.26,39.76
  pour Top (isolate 0.203): 115.21,17.97 122.99,17.97 122.99,15.52 122.39,14.92 116.57,14.92 115.21,16.28
  pour Top (isolate 0.203): 114.3,46.8 128.14,46.8 128.52,46.42 128.52,40.45 128.14,40.07 114.24,40.07 113.98,40.32 113.98,46.48
CURR#3
  Top 0.305: IC5.11 93.97,11.45 94.5,11.99 94.5,19.58 93.03,21.05
  Top 0.406: Q2.2 83.57,24.38 R15.2
  pour Top: 84.87,27.81 93.22,27.81 93.22,20.82 84.87,20.82
CURR_IN#3
  Top 0.813: OK2.3 72.81,17.93 Q1.4
  pour Top (isolate 0.203): 71.32,27.81 79.45,27.81 79.45,20.93 71.32,20.93
DIAG#1  (via drill 0.4)
  Top 0.203: R4.1 55.97,20.3 v57.02,20.3 | IC1.14 51.94,19.34 v52.05,19.24
  Power 0.203: X3.3 81.14,65.2 81.14,63.37 78.37,60.6 71.69,60.6 61.21,50.12 60.91,49.82 59.49,48.4 59.49,23.17 57.02,20.71 v57.02,20.3
  Bottom 0.203: v52.05,19.24 52.05,19.67 52.68,20.3 v57.02,20.3
DIAG#2  (via drill 0.4)
  Top 0.203: IC3.14 54.15,36.01 v54.18,36.04 | R9.1 60.12,36.79 v60.21,36.88
  Power 0.203: X3.4 82.36,64 78.55,60.2 71.87,60.2 59.91,48.23 59.91,37.18 v60.21,36.88
  Bottom 0.203: v60.21,36.88 60.2,36.89 54.46,36.89 54.18,36.61 v54.18,36.04
GND  (via drill 0.4)
  Top 0.203: v111.04,19.91 111.04,19.44 C57.2 | R28.1 v92.76,28.93 | C22.1 90.87,31.66 v90.84,31.68 | C19.1 101.05,26.86 v101.07,26.87 | C18.1 95.72,16.33 v95.86,16.19 | OK1.2 v51.49,9.57 | v100.79,13.6 100.79,14.53 R27.2 | OK3.2 v81.14,13.29 | OK2.2 81.19,17.88 v81.18,17.87 | IC7.5 v85.08,28.55
  Top 0.254: C64.2 110.72,38.08 v110.15,37.68 | C63.2 v112.55,38.24
  Top 0.406: IC12.2 v111.1,10.87 110.35,10.87 C46.2 | C56.2 v113.41,39.23 | IC13.1 111.15,8.66 v110.52,8.66 | C20.2 v113.16,57.5 | IC3.15 55.05,37.28 C11.2 v55.24,36.15 | IC1.15 52.63,20.61 C3.2 53.15,20.09 v53.15,19.43 | IC5.5 86.87,12.72 v86.41,13.18 | C21.1 91.03,33.63 v91.05,33.61
  Top 0.508: v48.87,66.6 IC2.9 | D3.2 D2.1 60.74,17.8 JP5.2 61.51,15.59 R19.1
  Top 0.61: C47.2 109.83,8.66 v110.52,8.66 | C48.1 116.03,9.75 v115.68,9.41 | C49.1 118.58,7.29 v118.92,7.63
  Top 1.016: D5.2 D4.1 99.54,46.95 R31.1 95.68,43.08 JP6.2
  other vias: 55.8,28.98 54.72,12.65 56.58,28.98 54.72,13.45 110.93,37.68 118.92,6.93 118.61,26.84 118.61,27.66 118.61,28.47 126.2,31.94 126.07,34.13 124.19,34.85 119.42,27.66 119.42,28.47 119.42,26.84 49.67,66.6 48.07,66.6 115.68,10.18
  pour Top (isolate 0.203, rank 2): 127.5,22.39 118.3,22.39 118.3,34.62 118.97,35.29 119.49,35.29 121.39,37.18 127.04,37.18 127.5,36.73
  pour Top (isolate 0.203): 49.52,13.15 52.36,13.15 53.2,13.99 57.18,13.99 57.18,11.82 56.79,11.44 50.81,11.44 49.52,12.73
  pour Top (isolate 0.203): 51.59,29.84 54.43,29.84 55.27,30.68 59.25,30.68 59.25,28.51 58.86,28.13 52.88,28.13 51.59,29.42
  pour Gnd (isolate 0.203): 47.18,22.15 47.12,0.05 131.19,0.05 131.95,0.81 131.95,67.55 131.13,68.37 0.64,68.37 -0.06,67.67 -0.06,40.31 0,40.24 16.57,40.24 19.43,43.1 19.43,53.9 21.27,55.74 35.75,55.74 47.24,44.24 47.24,28.43 47.94,27.73 58.29,27.73 58.74,27.29 58.74,22.46 58.42,22.15
GNDI1  (via drill 0.4)  (1 unrouted)
  Top 0.406: R12.2 36.59,26.45 | L2.2 v34.81,28.14 35.24,28.14 36.74,26.64 R12.2 | IC3.8 42.88,29.66 42.27,29.05 42.27,26.44 41.2,25.37 37.69,25.37 36.78,26.28 R12.2
  Top 0.813: C15.2 37.44,30.66 v37.4,30.67 C16.2
  Bottom 0.813: 39.32,36.13 37.4,34.21 v37.4,30.67 37.34,30.67 v34.81,28.14
  other vias: 39.33,36.14
  pour Top (isolate 0.203): 38.15,38.05 42.02,38.05 42.47,37.6 42.47,36.09 41.54,36.09 40.98,35.53 39.22,35.53 38.15,36.6
HI_CLAMP
  Top 0.203: IC4.10 IC4.5 | R27.1 R26.2 98.89,17.05
  Top 0.254: 98.89,17.05 98.89,17.04 98.81,16.96 98.81,18.37 98.92,18.49 98.92,19.2 IC4.5
HI_CURR#1
  Bottom 3.81: ISEL10A_2.12 ISEL10A_2.22
  pour Top (isolate 0.203, no thermals): 92.2,54.23 94.7,54.23 95.97,52.96 95.97,49.98 94.96,48.97 92.33,48.97 91.78,48.42 91.78,45.73 88.44,45.73 88.23,45.51 87.38,45.51 87.38,49.37 88.06,50.06 89.74,50.06 90.75,51.08 90.75,52.78
IN1N  (via drill 0.4)
  Top 0.203: IC1.10 51.87,14.26 52.46,14.86 58.19,14.86 v59.03,14.02 | IC11.15 111.45,24.38 111.61,24.23 111.61,23.67 104.86,16.93 104.86,14.18 103.03,12.35 96.67,12.35 v96.06,11.74
  Bottom 0.203: v59.03,14.02 59.47,14.02 61.44,12.05 95.76,12.05 v96.06,11.74
IN1P  (via drill 0.4)
  Top 0.203: IC1.11 51.58,15.53 51.84,15.26 58.81,15.26 v59.04,15.03 | v96.05,12.76 102.87,12.76 104.46,14.35 104.46,17.13 110.43,23.1 IC11.16
  Bottom 0.203: v59.04,15.03 61.62,12.46 95.75,12.46 v96.05,12.76
IN2N  (via drill 0.4)
  Top 0.203: IC11.13 108.86,25.38 v108.64,25.16
  Top 0.254: IC3.10 54.53,30.93 v54.81,31.21
  Bottom 0.203: v54.81,31.21 v54.81,31.2 55.07,30.95 61.4,30.95 68.92,23.43 95.9,23.43 96.61,22.72 106.2,22.72 v108.64,25.16
IN2P  (via drill 0.4)
  Top 0.203: IC11.14 109.38,24.88 v108.62,24.13
  Top 0.254: v54.06,32.2 IC3.11
  Bottom 0.203: v54.06,32.2 54.06,30.96 54.5,30.53 61.24,30.53 68.76,23.01 95.73,23.01 96.43,22.31 106.39,22.31 108.2,24.13 v108.62,24.13
IN3N  (via drill 0.4)
  Top 0.203: R25.1 68,16.68 v67.98,16.7 | R15.1 v83.35,20.58 | v100.43,21.52 100.67,21.77 103.45,21.77 108.07,26.38 IC11.11
  Top 0.254: JP3.1 62.19,11.2 64.34,13.34 64.34,14.12 R19.2
  Top 0.406: X1.6 18.85,25.21 v20.83,23.24 | v57.23,23.42 63.13,23.42 D3.1
  Top 0.508: D3.1 D2.2 64.71,16.79 JP5.1 64.23,15.69 | R25.1 64.26,15.67 64.23,15.69 | 64.23,15.69 64.23,14.25 R19.2
  Bottom 0.203: v67.98,16.7 67.98,17.54 69.41,18.96 83.35,18.96 | 83.35,18.96 93.02,18.96 95.49,21.43 100.34,21.43 v100.43,21.52 | v83.35,20.58 83.35,18.96
  Bottom 0.406: v20.83,23.24 v20.83,23.25 22.34,24.76 55.88,24.76 v57.23,23.42
IN3P  (via drill 0.4)
  Top 0.203: v92.11,16.53 IC5.15 | IC4.6 99.53,20.66 v99.59,20.72 100.8,20.72 101.44,21.36 102.82,21.36 | IC4.2 96.93,20.65 v96.86,20.72 | D1.3 102.76,18.02 102.76,18.03 102.82,18.09 102.82,21.36 | 102.82,21.36 103.63,21.36 108.16,25.88 IC11.12
  Top 0.305: IC5.7 90.16,10.18 | 90.16,10.18 IC5.10 | IC5.2 90.16,16.53 | 90.16,16.53 90.16,10.18 | 90.16,16.53 v92.11,16.53
  Bottom 0.203: v99.59,20.72 v96.86,20.72 95.39,20.72 92.11,17.45 v92.11,16.53
IN4N  (via drill 0.4)
  Top 0.203: R35.1S 82.97,47 83.38,46.59 83.38,45.11 v83.48,45.01 83.22,44.75 68.91,44.75 R39.1 | 104.22,34.82 v104.19,34.8 104.19,28.14 104.95,27.38 IC11.9
  Top 0.406: JP1.1 66.04,42.13 R39.1
  Bottom 0.203: v104.19,34.8 104.19,35.35 94.94,44.6 83.88,44.6 v83.48,45.01
IN4P  (via drill 0.4)
  Top 0.203: IC4.13 96.93,23.55 v96.86,23.48 | v99.64,23.48 99.53,23.59 IC4.9 99.54,24.88 99.54,25.84 99.77,26.07 102.8,26.07 D10.3 103.8,26.88 IC11.10
  Top 0.254: IC7.11 86.35,32.53 | 86.35,32.53 87.62,31.26 IC7.7 87.62,28.64 87.86,28.39 90.5,28.39 v90.91,28.81 | 81.27,32.59 IC7.15 | 86.35,32.53 81.32,32.53 81.27,32.59 | IC7.3 82.54,30.64 81.27,31.91 81.27,32.59
  Bottom 0.203: v99.64,23.48 v96.86,23.48 96.44,23.48 96.06,23.86 95.86,23.86 v90.91,28.81
ISEL10_R#4
  Top 0.203: IC2.8 49.76,64.66 51.56,62.86 58.48,62.86 X3.22
ISEL10_S#4
  Top 0.203: IC2.7 50.43,63.4 51.37,62.45 60.62,62.45 X3.20
ISEL10A_R4_OUT  (via drill 0.4)
  Top 0.203: IC2.11 45.35,64.66 v45.4,64.72 | ISEL10A_2.A1 106.19,62.35 81.75,62.35 79.82,60.42 58.88,60.42 v58.57,60.12
  Power 0.203: v45.4,64.72 47.41,64.72 51.23,60.89 57.8,60.89 v58.57,60.12
ISEL10A_S4_OUT  (via drill 0.4)
  Top 0.203: IC2.12 44.09,63.4 v44.6,63.9 | v59.35,59.41 59.96,60.02 80,60.02 81.92,61.94 103.1,61.94 106.59,58.44 106.59,54.45 ISEL10A_2.A2
  Power 0.203: v44.6,63.9 47.64,63.9 51.05,60.49 57.17,60.49 58.26,59.41 v59.35,59.41
ISEL#3  (via drill 0.4)
  Top 0.203: IC5.9 v94.14,8.91 | R14.2 85.04,18.25 v85.03,18.26
  Power 0.203: v94.14,8.91 92.96,10.09 92.96,17.17 92,18.13 v91.58,18.13
  Bottom 0.203: v85.03,18.26 91.45,18.26 v91.58,18.13
ISEL_LOW#4  (via drill 0.4)
  Top 0.203: 80,34.73 IC7.16 73.94,34.97 v73.42,34.45 | v62.89,58.52 62.89,55.14 68.57,49.46 v69.04,49.46
  Power 0.203: X3.23 58.36,65.26 58.36,63.34 59.17,62.53 59.85,62.53 62.89,59.5 v62.89,58.52 | v73.42,34.45 73.42,40.88 69.34,44.95 69.34,49.16 v69.04,49.46
ISEL_MID#4  (via drill 0.4)
  Top 0.203: Q4.1 v88.46,42.82 | v77.44,45.7 71.77,45.7 62.09,55.38 v62.09,57.55
  Top 0.254: Q4.1 Q3.1 88.89,39.29 IC7.9
  Power 0.203: v88.46,42.82 80.33,42.82 v77.44,45.7 | v62.09,57.55 62.09,59.73 59.69,62.12 58.95,62.12 X3.24
ISEL_R2_OUT
  Top 0.203: IC2.15 41.1,59.59 48.7,51.98 ISEL10A_1.A1
ISEL_R4_OUT  (via drill 0.4)  (1 unrouted)
  Top 0.203: IC2.13 40.39,62.14 41.52,61.01 41.52,60.33 47.41,54.44 55.83,54.44 62.79,47.48 v62.79,47.25 | ISEL1A_1.7 64.54,33.12
  Power 0.203: v64.52,33.22 62.79,34.95 v62.79,47.25
ISEL_R#2
  Top 0.203: IC2.4 49.87,59.59 51.52,61.24 74.64,61.24 X3.8
ISEL_R#4
  Top 0.203: IC2.6 48.95,62.05 62.75,62.05 X3.18
ISEL_S2_OUT  (via drill 0.4)
  Top 0.203: IC2.16 41.76,58.31 46.85,53.22 v46.85,52.6
  Bottom 0.203: ISEL10A_1.A2 47,44.85 47,52.45 v46.85,52.6
ISEL_S4_OUT  (via drill 0.4)
  Top 0.203: IC2.14 40.41,60.85 47.23,54.03 55.65,54.03 61.91,47.77 61.91,47.1 62.79,46.23 64.82,46.23 v66.28,44.76 | ISEL1A_1.12 77.24,31.37 77.01,31.59 73.89,31.59 v73.88,31.61
  Power 0.203: v73.88,31.61 69.99,31.61 68.72,32.88 68.72,42.33 v66.28,44.76
ISEL_S#2
  Top 0.203: IC2.3 49.99,58.31 50.57,58.9 50.57,59.71 51.69,60.83 76.77,60.83 X3.6
ISEL_S#4
  Top 0.203: IC2.5 50.56,60.85 51.35,61.64 64.88,61.64 X3.16
LO_CLAMP
  Top 0.203: R28.2 R29.1 97.58,26.27 IC4.12 IC4.3
N$1
  Top 0.203: IC11.52 118.3,34.16 119.01,34.87 119.86,34.87 121.01,36.01 121.01,38.1 121.58,38.67 R52.1
N$2
  Top 0.406: R1.2 L1.P$1
N$3
  Top 0.203: IC12.3 112.79,10.22 112.93,10.36 112.93,11.3 112.71,11.52 IC12.1
  Top 0.406: C46.1 111.26,12.37 IC12.1
  Top 0.508: C46.1 109.92,12.37
  Top 0.61: C46.1 109.92,12.61 L4.P$1
N$9
  Top 0.203: IC13.3 110.5,6.29 C47.1
  Top 0.508: IC13.2 109.73,7.24 C47.1
  Top 0.61: L5.P$1 C47.1
N$13  (via drill 0.4)
  Top 0.406: L3.P$2 46.15,25.64 v45.67,26.12 | X1.5 7.41,23.21 v17.92,23.21
  Bottom 0.406: v45.67,26.12 20.83,26.12 v17.92,23.21
N$14
  Top 0.203: R52.2 JP8.COM
N$15
  Top 0.406: R5.1 R7.2 38.19,3.9 40.62,6.32 40.62,7 OK1.4 40.7,6.98 41.48,6.98 43.31,8.81 43.31,14.51 42.29,15.53 IC1.6
N$16
  Top 0.406: R3.2 R1.1
N$17
  Top 0.406: R5.2 R3.1
N$18
  Top 0.254: ISEL10A_1.22 30.94,40.64 30.94,30.93 30.07,30.07 28.7,30.07 28.5,30.27 R11.2S
N$19
  Top 3.81: 27.83,32.84 27.74,32.75 26.62,32.75 19.58,39.79 19.58,42.02 19.58,42.52 19.58,45.17 21.26,46.85 30.25,46.85 33.44,50.04 ISEL10A_1.12
  pour Top (isolate 0.203, no thermals): 26.82,34.96 29.78,34.96 30,34.74 30,32.05 27.14,32.05 26.7,32.5 26.7,34.83
N$20
  Top 0.406: OK1.3 40.59,9.62 R6.2
N$21
  Top 0.406: IC1.1 39.1,21.88 C2.1 C1.1 36.14,22.39 35.79,22.03 35.79,20.04 38.34,17.48 C4.2 38.93,17.48 39.84,18.4 39.84,19.12 40.06,19.34 IC1.3
N$25
  Top 0.406: IC1.5 39.85,16.8 39.45,16.39 38.16,15.1 37.59,15.67 38.27,15.67 C7.1 C8.1
N$28
  Top 0.406: IC1.16 C3.1 54.08,20.86 54.08,18.97 53.17,18.07 IC1.13
N$29
  Top 0.406: IC3.6 42.82,32.2 40.56,29.94 C17.1 40.34,28.61 R10.1
N$30
  Bottom 3.81: F4.1 78.96,57.34 80.44,55.85 88.67,55.85 | 88.67,55.85 ISEL10A_2.11 | 88.67,55.85 ISEL10A_2.21
N$31
  Top 0.406: IC3.1 41.24,38.55 C10.1 C9.1 38.28,39.16 37.88,38.77 37.88,36.45 40.07,34.26 C12.2 41.71,35.34 41.71,35.73 41.99,36.01 IC3.3
N$32
  pour Top (isolate 0.203): 43.57,33.66 39.89,33.66 38.84,34.72 35.13,34.72 34.81,34.4 34.81,32.34 35.27,31.89 40.75,31.89 42.16,33.3 43.57,33.3
N$33
  Top 0.406: IC3.13 55.22,34.74 56.22,35.75 56.22,37.82 C11.1 55.01,38.55 IC3.16
N$37  (via drill 0.4)
  Top 0.254: v31.9,29.89 31.9,29.25 L2.4
  Bottom 0.254: v31.9,29.89 31.9,39.87 28.62,43.15 ISEL10A_1.21
N$44
  Bottom 3.81: F2.1 12.28,19.23 F1.1 12.28,37.88 21.25,46.85 25.5,46.85 28.4,49.75 ISEL10A_1.11
N$55
  Top 0.254: L2.1 29.41,28.14 28.5,27.23 R11.1S
N$56  (via drill 0.4)
  Top 0.203: IC5.14 91.89,15.26 v91.52,15.63 | v69.09,17.08 69.09,17.42 R25.2
  Top 0.406: R24.1 R25.2
  Bottom 0.203: v91.52,15.63 74.19,15.63 73.68,16.14 73.22,16.61 72.75,17.08 v69.09,17.08
N$57
  Top 0.203: IC5.6 86.86,11.45 86.37,10.97 86.37,9.64 85.52,8.79 74.44,8.79 OK3.4
N$58
  Top 0.406: R18.1 70.52,8.4 71.14,9.03 71.14,11.63 72.4,12.89 OK3.3
N$59
  Top 0.203: D1.2 101.92,19.93 101.91,19.91 100.19,19.91 100.18,19.92 IC4.7
N$60  (via drill 0.4)
  Top 0.203: D1.1 103.82,20.52 103.57,20.27 v103.57,19.29 | IC4.1 96.23,19.19 v95.89,19.19
  Bottom 0.203: v103.57,19.29 103.47,19.19 v95.89,19.19
N$61
  Top 0.406: R17.1 67.73,8.05 R18.2
N$62  (via drill 0.4)
  Top 0.203: IC5.3 87.08,15.26 85.92,16.43 84.16,16.43 84.01,16.58 84.01,18.51 83.48,19.05 75.08,19.05 v74.13,20 | v65.2,24.29 65.2,25.14 64.71,25.64
  Top 0.406: R22.1 64.71,25.64 R23.2
  Bottom 0.203: v65.2,24.29 69.05,20.44 73.69,20.44 v74.13,20
N$63
  Top 0.406: R23.1 68.06,23.54 R24.2
N$64
  Top 0.406: R21.1 R22.2
N$65
  Top 0.406: R20.1 R21.2
N$66
  Top 0.203: OK2.1 82.55,15.48 R14.1
N$67
  Top 0.203: R16.2 84.48,13.43 83.84,12.8 83.84,11.78 OK3.1
N$68
  Top 0.406: Q2.3 85.41,22.07 84.45,23.02 82.17,23.02 81.08,21.93 F3.2 80.68,22.07 Q1.1
N$69
  Top 0.406: Q1.3 78.98,26.69 80.09,27.8 82.6,27.8 83.2,27.2 83.2,26.7 R13.2 83.19,26.69 Q2.1
N$71  (via drill 0.4)
  Top 0.254: R8.2 28.5,36.08 28.26,35.84 27.11,35.84 25.59,37.36 25.26,37.69 23.36,39.59 ISEL10A_1.24
  Bottom 0.203: 28.84,38.11 28.84,38.49 v28.63,38.71
  Bottom 2.032: F2.2 27.26,38.11 28.84,38.11
  other vias: 29.44,38.71 27.83,38.71 27,38.71
  pour Top (isolate 0.203, no thermals): 26.87,39.07 29.57,39.07 29.77,38.87 29.77,36.37 27.22,36.37 26.72,36.86 26.67,36.92 26.67,38.85 26.67,38.87
N$72
  Top 0.406: R13.1 81.26,24.86 F3.1
N$73
  Top 0.203: OK1.1 50.75,7.59 R2.1
N$75
  Top 0.254: R10.2 36.78,29.15 | 36.78,29.15 36.8,29.17 | L2.3 36.69,29.24 36.78,29.15
N$77
  Top 0.406: IC3.7 42.81,30.93 41.66,29.78 41.66,28.23 C17.2 40.32,26.89 38.85,26.89 38.68,26.73 R12.1
N$81
  Top 0.254: Q4.3 Q3.3
N$92
  Top 0.254: C33.2 119.07,20.21 118.3,20.21 117.8,20.71 IC11.28
N$93
  Top 0.254: IC11.30 118.8,20.86 118.99,20.67 120.78,20.67 122.24,19.21 C27.2
N$94
  Top 0.254: C25.2 117.79,35.44 116.8,34.45 IC11.55
  Top 0.406: 117.68,37.2 117.74,37.26 117.74,36.85 C25.2 117.45,37.14 116.18,37.14 C26.1
N$95
  Top 0.254: IC11.26 116.8,21.05 117.97,19.89 C23.2
N$96  (via drill 0.4)
  Top 0.203: IC11.37 120.36,25.88 v120.34,25.87 | JP9.2 124.2,28.38 v124.36,28.22
  Bottom 0.203: v120.34,25.87 122.01,25.87 v124.36,28.22
N$98  (via drill 0.4)
  Top 0.203: 123.84,18.26 R51.1 123.88,18.64 123.88,19.48 v123.84,19.52 | IC11.35 122.78,24.88 v123.53,24.13
  Bottom 0.203: 123.72,19.63 v123.84,19.52 123.53,19.82 v123.53,24.13
N$100
  Top 0.61: C35.2 115.25,44.72 R65.1
N$137
  Top 0.508: IC2.10 37.08,65.94 ZD1.C
N$141
  Top 2.54: ISEL10A_2.14 ISEL10A_2.24 77.9,52.06 76.47,50.63 F5.2
N$154  (via drill 0.4)
  Top 0.254: JP1.2 v61.16,42.13
  Power 0.254: v61.16,42.13 61.16,23.17 57.09,19.1 X2.23
N$155
  Top 0.254: JP3.2 58.23,8.61 54.54,4.92 X2.25
N$156  (via drill 0.4)
  Top 0.254: v78.66,37.34 79.75,37.34 JP2.1
  Power 0.254: X2.24 58.36,3.24 58.36,6.16 57.58,6.93 57.58,18.92 61.62,22.96 61.62,36.38 v61.9,36.66
  Bottom 0.254: v78.66,37.34 62.57,37.34 v61.9,36.66
N$157
  Top 0.254: JP4.1 64.86,8.15 63.68,6.97 57.75,6.97 55.84,5.06 55.84,3.26 X2.26
N$170
  Top 0.254: R30.1 90.79,42.9 89.66,44.03 88.21,44.03 Q4.2 87.01,41.96 86.09,41.04 86.09,37.49 87.62,35.96 IC7.10
  Top 1.016: R32.2 93.89,45.67 R30.1
N$173
  Top 0.254: R34.2 98.07,38.01 D9.2
  Top 1.016: D7.2 D8.1 D9.2 D6.1
N$182  (via drill 0.4)
  Top 0.203: IC7.14 82.54,36.36 v82.14,36.75
  Top 0.254: R33.2 98.03,32.14 99.54,30.63 | Q3.2 v87.01,40.52 | R30.2 91.58,40.05 91.63,40
  Top 0.813: ISEL1A_1.5 v67.08,35.63 ISEL1A_1.8
  Top 1.016: D7.1 D6.2 99.54,30.63 v99.54,31.26 | v92.67,40 91.63,40
  Power 1.016: v99.54,31.26 99.54,33.13 v92.67,40
  Bottom 0.254: v82.14,36.75 82.14,35.67 82.5,35.63 | v87.01,40.52 92.15,40.52 v92.67,40
  Bottom 1.016: v67.08,35.63 82.5,35.63 95.17,35.63 v99.54,31.26
N$183
  Top 0.254: R34.1 94.72,36.1 IC6.4 94.5,36.04 92.75,34.29 IC6.1
N$184
  Top 0.254: R33.1 94.81,34.04 94.64,34.21 94.64,33.66 IC6.3
N$187
  Top 0.406: R38.2 75.72,42.01 R37.1
N$189  (via drill 0.4)
  Top 0.254: R38.1 70.98,41.65 70.87,41.54 v70.87,33 | v81.27,30.83 IC7.2
  Top 0.406: R39.2 R38.1
  Bottom 0.203: v70.87,33 71.28,32.59 79.52,32.59 v81.27,30.83
N$192  (via drill 0.4)
  Top 0.203: v83.08,40.46 83.08,40.88 R36.1 | v83.06,31.67 85.29,31.67 86.35,30.62 IC7.6
  Power 0.203: v83.06,31.67 83.06,40.43 v83.08,40.46
N$199
  Top 0.203: IC4.8 102.75,24.88 D10.2
N$200  (via drill 0.4)
  Top 0.203: IC4.14 v95.87,24.88 | v101.21,23.78 101.94,23.78 D10.1
  Bottom 0.203: v95.87,24.88 100.11,24.88 v101.21,23.78
USEL1#3  (via drill 0.4)
  Top 0.203: v79.23,11.12 81.17,9.19 83.73,9.19 v84.98,10.44 85.04,10.5 R16.1 | IC5.8 89.64,8.91 v90.17,8.38
  Power 0.203: v79.23,11.12 79.23,20.51 76.96,22.78 76.96,39.67 73.89,42.74 73.89,55.97 72.87,56.98 v72.67,56.98
  Bottom 0.203: v90.17,8.38 88.23,10.32 85.09,10.32 v84.98,10.44 | X3.11 73.61,65.25 73.61,62.98 72.75,62.11 72.75,57.06 v72.67,56.98
USEL1#4  (via drill 0.4)
  Top 0.203: IC7.8 88.89,31.76 v87.52,33.13
  Power 0.203: v87.52,33.13 87.5,33.13 87.5,38.36 83.48,42.39 77.65,42.39 74.3,45.74 74.3,56.37 72.75,57.92 v72.03,57.92
  Bottom 0.203: X3.12 72.32,58.21 v72.03,57.92
USEL5#4  (via drill 0.4)
  Top 0.203: IC7.1 80,31.54 78,33.54 v74.38,33.54
  Power 0.203: v69.76,56.08 69.76,45.13 74.38,40.51 v74.38,33.54
  Bottom 0.203: v69.76,56.08 69.78,56.1 X3.14
USEL20#3  (via drill 0.4)
  Top 0.203: IC5.1 86.12,19.45 77.64,19.45 v77.32,19.77
  Power 0.203: v77.32,19.77 76.15,20.94 76.15,39.34 70.8,44.69 v70.8,56.98
  Bottom 0.203: v70.8,56.98 71.06,57.24 71.06,65.26 X3.13
USEL100#3  (via drill 0.4)
  Top 0.203: IC5.16 93.15,18.35 91.64,19.86 78.74,19.86 v78.45,20.15
  Power 0.203: v78.45,20.15 78.45,20.16 76.56,22.06 76.56,39.51 73.48,42.58 73.48,55.25 v72.91,55.83
  Bottom 0.203: X3.9 76.12,65.28 76.12,62.72 73.38,59.98 73.38,56.3 v72.91,55.83
USEL#1  (via drill 0.4)
  Top 0.203: v52.95,10.45 R2.2
  Power 0.203: X3.5 78.66,65.26 78.66,62.45 77.22,61.01 71.51,61.01 59.08,48.57 59.08,23.35 52.95,17.22 v52.95,10.45
VREFP  (via drill 0.4)
  Top 0.203: IC8.6 117.84,42.41 C35.1
  Top 0.254: IC11.24 115.8,20.42 C28.1 114.53,18.57 113.69,17.72 113.1,17.72 C34.1 v112.06,17.1
  Top 0.406: IC8.7 117.5,41.76 | 117.5,41.76 C35.1 | 117.5,41.76 117.25,41.76 v116.32,40.83
  Bottom 0.305: v112.06,17.1 109.69,19.48 109.69,27.81 109.04,28.46 109.04,38.58 111.29,40.83 v116.32,40.83
(copper drawn outside any net)
  shapes: Power area x13

## Text on the board
tPlace: EEZ DIB AFE3 / (04/2021 r1B2)
bPlace: Project source code: github.com/eez-open | EEZ DIB AFE3 / (04/2021 r1B2) | AIN4+ / / / AIN4- | AIN3+ / / / AIN3- | AIN2+ / / / AIN2- | ISO_I | AIN1+ / / / AIN1- | ISO_U